# Altium project Enigma Rev B.PrjPCB (part 5 of 8)

## Sheet I2S Audio.SchDoc: I2S Codec/Amplifier
size Tabloid; ApprovedBy: NA; CompanyName: Cospan Design LLC; DrawnBy: Dave McCoy; Engineer: Dave McCoy; DocumentNumber: 13; Revision: A; SheetNumber: 13; SheetTotal: 20; Client: Public; Project: Enigma; ProjectPrettyName: Enigma
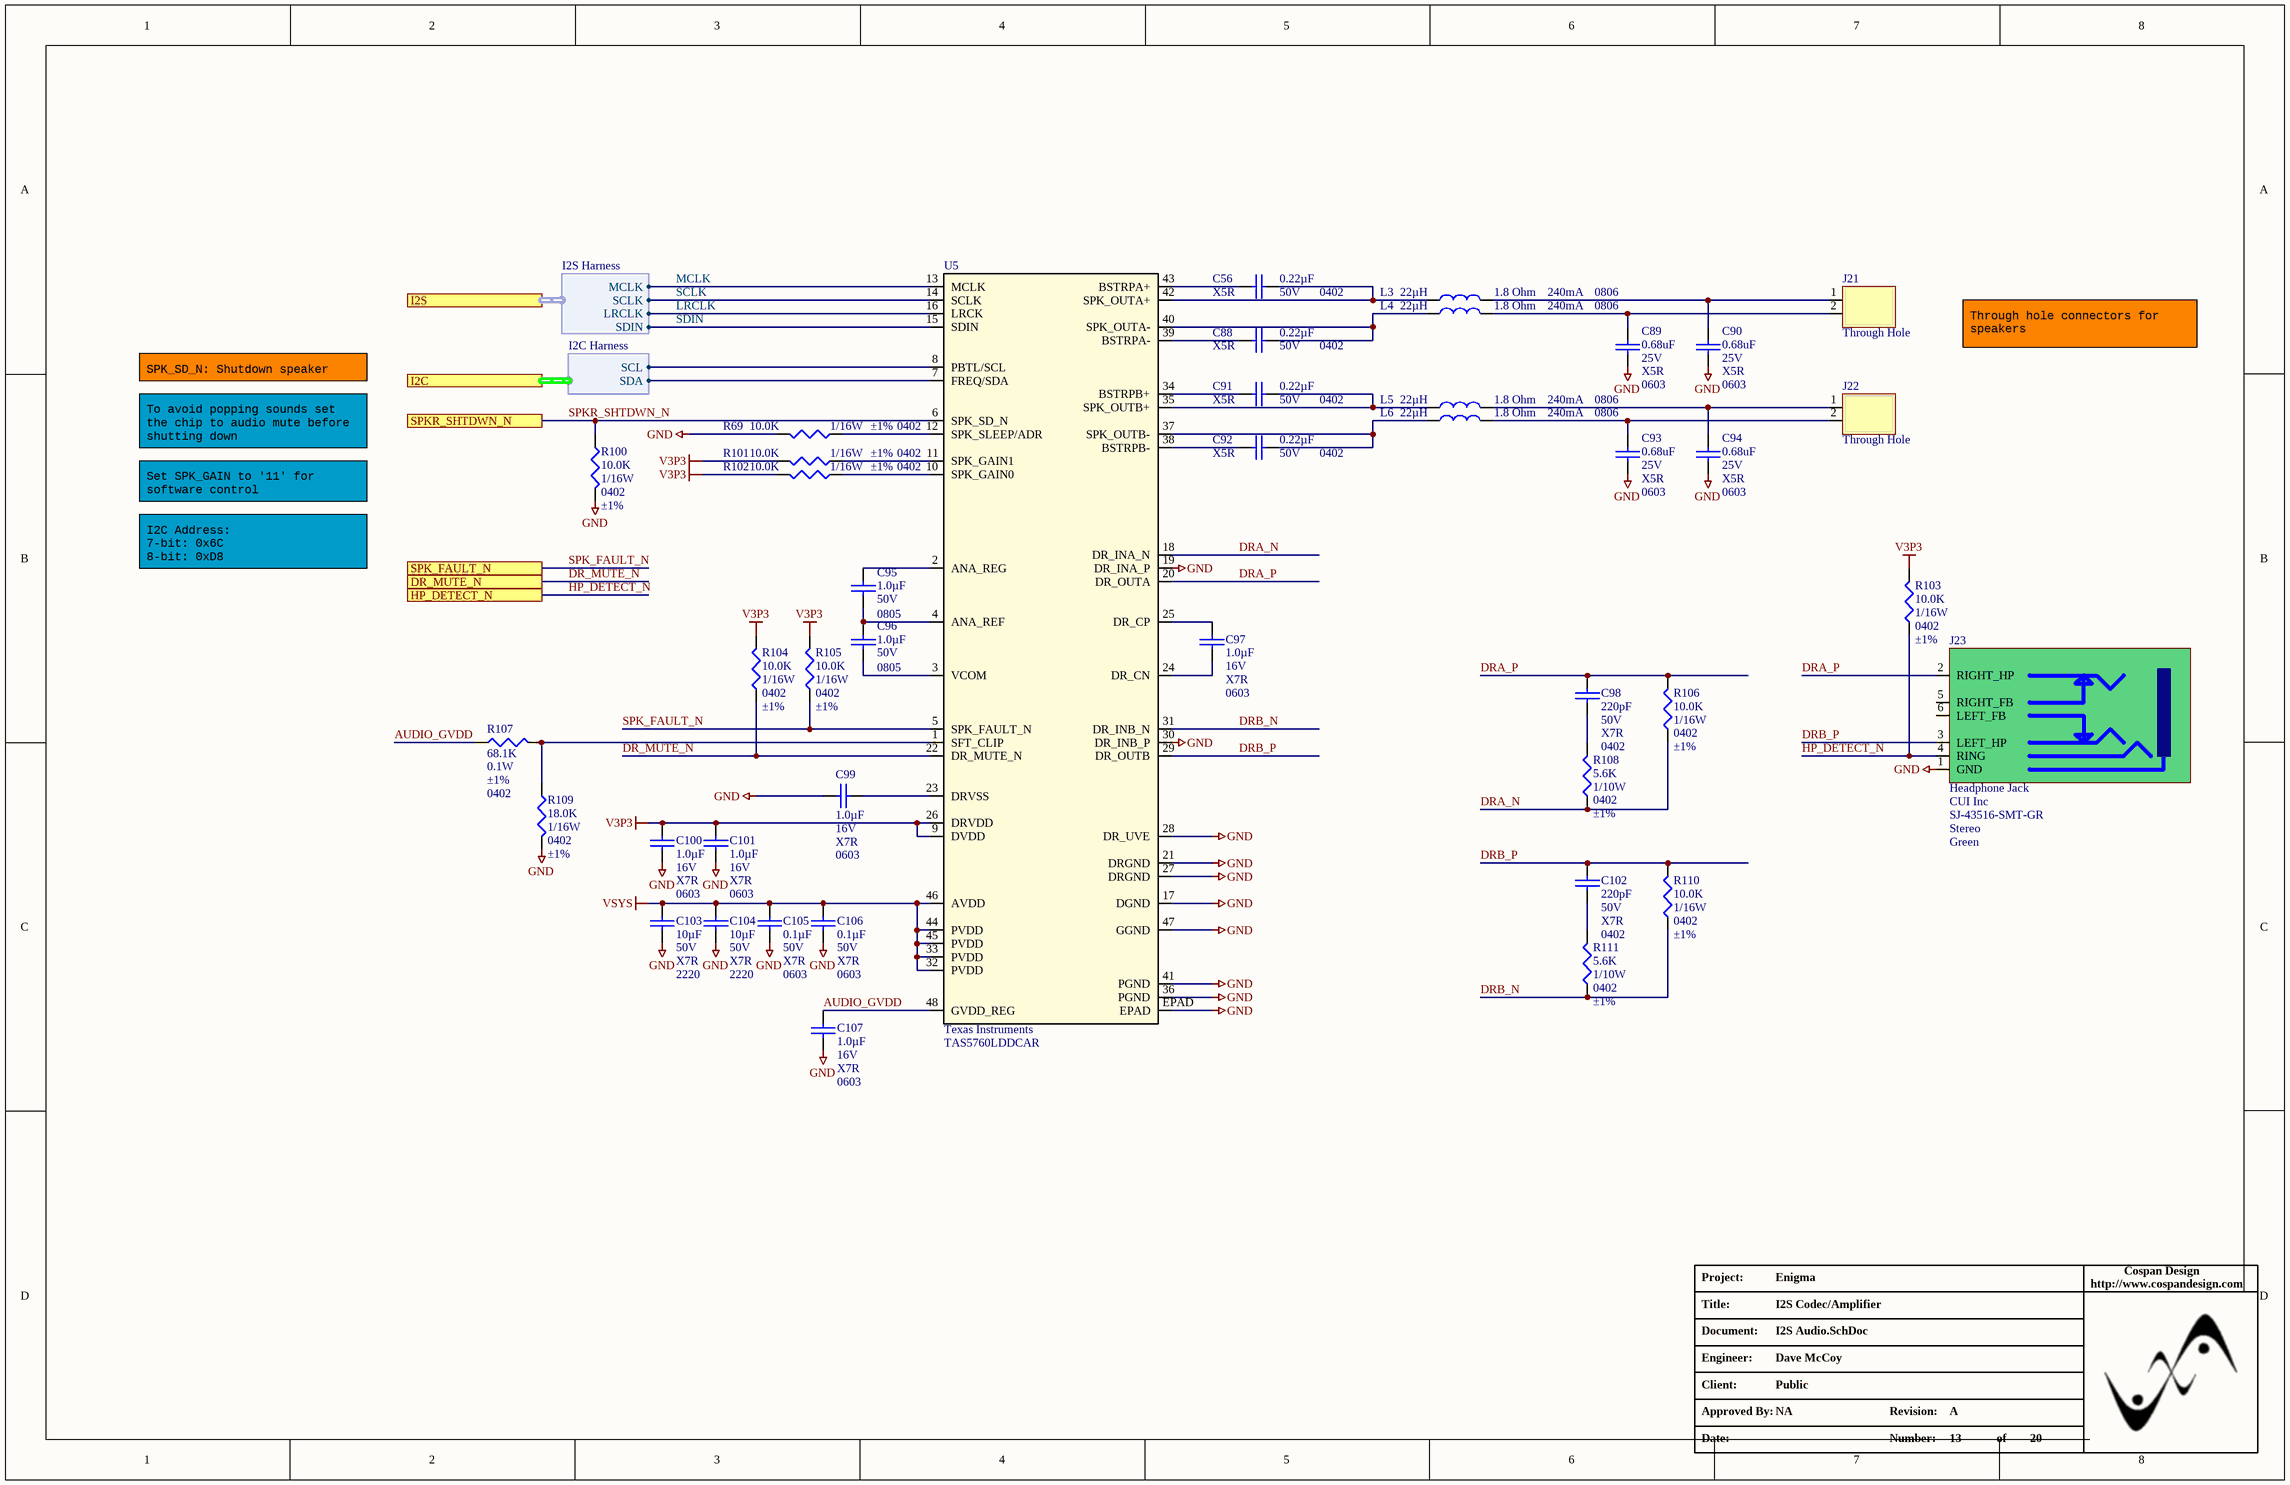
[diagram p8: I2S Audio.SchDoc]

### Parts
C56  Capacitance: 0.22µF  Voltage - Rated: 50V  Temperature Coefficient: X5R  Package / Case: 0402  [C_0402]  (hidden comment: C_0402_0.22UF_50V)
C88  Capacitance: 0.22µF  Voltage - Rated: 50V  Temperature Coefficient: X5R  Package / Case: 0402  [C_0402]  (hidden comment: C_0402_0.22UF_50V)
C89  Capacitance: 0.68uF  Voltage - Rated: 25V  Temperature Coefficient: X5R  Package / Case: 0603  [C_ERA-0603]  (hidden comment: C_0603_0.68uF_25V)
C90  Capacitance: 0.68uF  Voltage - Rated: 25V  Temperature Coefficient: X5R  Package / Case: 0603  [C_ERA-0603]  (hidden comment: C_0603_0.68uF_25V)
C91  Capacitance: 0.22µF  Voltage - Rated: 50V  Temperature Coefficient: X5R  Package / Case: 0402  [C_0402]  (hidden comment: C_0402_0.22UF_50V)
C92  Capacitance: 0.22µF  Voltage - Rated: 50V  Temperature Coefficient: X5R  Package / Case: 0402  [C_0402]  (hidden comment: C_0402_0.22UF_50V)
C93  Capacitance: 0.68uF  Voltage - Rated: 25V  Temperature Coefficient: X5R  Package / Case: 0603  [C_ERA-0603]  (hidden comment: C_0603_0.68uF_25V)
C94  Capacitance: 0.68uF  Voltage - Rated: 25V  Temperature Coefficient: X5R  Package / Case: 0603  [C_ERA-0603]  (hidden comment: C_0603_0.68uF_25V)
C95  Capacitance: 1.0µF  Voltage - Rated: 50V  Package / Case: 0805  [C_ERA-0805]  (hidden comment: 1.0uF)
C96  Capacitance: 1.0µF  Voltage - Rated: 50V  Package / Case: 0805  [C_ERA-0805]  (hidden comment: 1.0uF)
C97  Capacitance: 1.0µF  Voltage - Rated: 16V  Temperature Coefficient: X7R  Package / Case: 0603  [C_ERA-0603]  (hidden comment: 1.0uF)
C98  Voltage - Rated: 50V  Temperature Coefficient: X7R  Package / Case: 0402  [C_0402]  (hidden comment: 220pF)
C99  Capacitance: 1.0µF  Voltage - Rated: 16V  Temperature Coefficient: X7R  Package / Case: 0603  [C_ERA-0603]  (hidden comment: 1.0uF)
C100  Capacitance: 1.0µF  Voltage - Rated: 16V  Temperature Coefficient: X7R  Package / Case: 0603  [C_ERA-0603]  (hidden comment: 1.0uF)
C101  Capacitance: 1.0µF  Voltage - Rated: 16V  Temperature Coefficient: X7R  Package / Case: 0603  [C_ERA-0603]  (hidden comment: 1.0uF)
C102  Voltage - Rated: 50V  Temperature Coefficient: X7R  Package / Case: 0402  [C_0402]  (hidden comment: 220pF)
C103  Voltage - Rated: 50V  Temperature Coefficient: X7R  Package / Case: 2220  [C_ERA-2220]  (hidden comment: 10µF)
C104  Voltage - Rated: 50V  Temperature Coefficient: X7R  Package / Case: 2220  [C_ERA-2220]  (hidden comment: 10µF)
C105  Capacitance: 0.1µF  Voltage - Rated: 50V  Temperature Coefficient: X7R  Package / Case: 0603  [C_ERA-0603]  (hidden comment: C_0603_0.1µF)
C106  Capacitance: 0.1µF  Voltage - Rated: 50V  Temperature Coefficient: X7R  Package / Case: 0603  [C_ERA-0603]  (hidden comment: C_0603_0.1µF)
C107  Capacitance: 1.0µF  Voltage - Rated: 16V  Temperature Coefficient: X7R  Package / Case: 0603  [C_ERA-0603]  (hidden comment: 1.0uF)
J21  Mounting Type: Through Hole  [HDR_1X2]  (hidden comment: J_HDR1X2_JUMPER)  (no BOM)
J22  Mounting Type: Through Hole  [HDR_1X2]  (hidden comment: J_HDR1X2_JUMPER)  (no BOM)
J23  Headphone Jack  Manufacturer: CUI Inc  Manufacturer Part Number: SJ-43516-SMT-GR  Signal Lines: Stereo  Color: Green  [HEADPHONE_JACK]
L3  Current: 240mA  Package / Case: 0806  Inductance: 22µH  DC Resistance (DCR): 1.8 Ohm  [L_0806]  (hidden comment: CBC2016T220K)
L4  Current: 240mA  Package / Case: 0806  Inductance: 22µH  DC Resistance (DCR): 1.8 Ohm  [L_0806]  (hidden comment: CBC2016T220K)
L5  Current: 240mA  Package / Case: 0806  Inductance: 22µH  DC Resistance (DCR): 1.8 Ohm  [L_0806]  (hidden comment: CBC2016T220K)
L6  Current: 240mA  Package / Case: 0806  Inductance: 22µH  DC Resistance (DCR): 1.8 Ohm  [L_0806]  (hidden comment: CBC2016T220K)
R69  Resistance In Ohms: 10.0K  Power (Watts): 1/16W  Case: 0402  Tolerance: ±1%  [R_0402]  (hidden comment: R_0402_10.0K)
R100  Resistance In Ohms: 10.0K  Power (Watts): 1/16W  Case: 0402  Tolerance: ±1%  [R_0402]  (hidden comment: R_0402_10.0K)
R101  Resistance In Ohms: 10.0K  Power (Watts): 1/16W  Case: 0402  Tolerance: ±1%  [R_0402]  (hidden comment: R_0402_10.0K)
R102  Resistance In Ohms: 10.0K  Power (Watts): 1/16W  Case: 0402  Tolerance: ±1%  [R_0402]  (hidden comment: R_0402_10.0K)
R103  Resistance In Ohms: 10.0K  Power (Watts): 1/16W  Case: 0402  Tolerance: ±1%  [R_0402]  (hidden comment: R_0402_10.0K)
R104  Resistance In Ohms: 10.0K  Power (Watts): 1/16W  Case: 0402  Tolerance: ±1%  [R_0402]  (hidden comment: R_0402_10.0K)
R105  Resistance In Ohms: 10.0K  Power (Watts): 1/16W  Case: 0402  Tolerance: ±1%  [R_0402]  (hidden comment: R_0402_10.0K)
R106  Resistance In Ohms: 10.0K  Power (Watts): 1/16W  Case: 0402  Tolerance: ±1%  [R_0402]  (hidden comment: R_0402_10.0K)
R107  Resistance In Ohms: 68.1K  Power (Watts): 0.1W  Tolerance: ±1%  Case: 0402  [R_0402]  (hidden comment: R_0402_68.1K)
R108  Resistance In Ohms: 5.6K  Power (Watts): 1/10W  Case: 0402  Tolerance: ±1%  [R_0402]  (hidden comment: 5.6k Ohms)
R109  Resistance In Ohms: 18.0K  Power (Watts): 1/16W  Case: 0402  Tolerance: ±1%  [R_0402]  (hidden comment: 18.0k Ohms)
R110  Resistance In Ohms: 10.0K  Power (Watts): 1/16W  Case: 0402  Tolerance: ±1%  [R_0402]  (hidden comment: R_0402_10.0K)
R111  Resistance In Ohms: 5.6K  Power (Watts): 1/10W  Case: 0402  Tolerance: ±1%  [R_0402]  (hidden comment: 5.6k Ohms)
U5  Manufacturer 1: Texas Instruments  Manufacturer Part Number 1: TAS5760LDDCAR  [DCA48_6P4X3P6]  (hidden comment: U_TAS5760LDDCAR)

### Ports
DR_MUTE_N, HP_DETECT_N, I2C (harness I2C Harness), I2S (harness I2S Harness), SPK_FAULT_N, SPKR_SHTDWN_N

### Harnesses
I2C Harness: SCL, SDA
I2S Harness: MCLK, SCLK, LRCLK, SDIN

### Nets
GND: C89.1 C90.1 C93.1 C94.1 C99.1 C100.1 C101.1 C103.1 C104.1 C105.1 C106.1 C107.1 J23.1(GND) R69.1 R100.1 R109.2 U5.17(DGND) U5.19(DR_INA_P) U5.21(DRGND) U5.27(DRGND) U5.28(DR_UVE) U5.30(DR_INB_P) U5.36(PGND) U5.41(PGND) U5.47(GGND) U5.EPAD
V3P3: C100.2 C101.2 R101.1 R102.1 R103.1 R104.2 R105.2 U5.9(DVDD) U5.26(DRVDD)
VSYS: C103.2 C104.2 C105.2 C106.2 U5.32(PVDD) U5.33(PVDD) U5.44(PVDD) U5.45(PVDD) U5.46(AVDD)
AUDIO_GVDD: C107.2 R107.1 U5.48(GVDD_REG)
DR_MUTE_N: R104.1 U5.22(DR_MUTE_N) ; port DR_MUTE_N
DRA_N: R106.2 R108.2 U5.18(DR_INA_N)
DRA_P: C98.2 J23.2(RIGHT_HP) R106.1 U5.20(DR_OUTA)
DRB_N: R110.2 R111.2 U5.31(DR_INB_N)
DRB_P: C102.2 J23.3(LEFT_HP) R110.1 U5.29(DR_OUTB)
FMC_SCL: U5.8(PBTL/SCL) ; port I2C.SCL
FMC_SDA: U5.7(FREQ/SDA) ; port I2C.SDA
HP_DETECT_N: J23.4(RING) R103.2 ; port HP_DETECT_N
LRCLK: U5.16(LRCK) ; port I2S.LRCLK
MCLK: U5.13(MCLK) ; port I2S.MCLK
SCLK: U5.14(SCLK) ; port I2S.SCLK
SDIN: U5.15(SDIN) ; port I2S.SDIN
SPK_FAULT_N: R105.1 U5.5(SPK_FAULT_N) ; port SPK_FAULT_N
SPKR_SHTDWN_N: R100.2 U5.6(SPK_SD_N) ; port SPKR_SHTDWN_N
NetC56_1: C56.1 L3.1 U5.42(SPK_OUTA+)
NetC56_2: C56.2 U5.43(BSTRPA+)
NetC88_1: C88.1 L4.1 U5.40(SPK_OUTA-)
NetC88_2: C88.2 U5.39(BSTRPA-)
NetC89_2: C89.2 J21.2 L4.2
NetC90_2: C90.2 J21.1 L3.2
NetC91_1: C91.1 L5.1 U5.35(SPK_OUTB+)
NetC91_2: C91.2 U5.34(BSTRPB+)
NetC92_1: C92.1 L6.1 U5.37(SPK_OUTB-)
NetC92_2: C92.2 U5.38(BSTRPB-)
NetC93_2: C93.2 J22.2 L6.2
NetC94_2: C94.2 J22.1 L5.2
NetC95_1: C95.1 C96.2 U5.4(ANA_REF)
NetC95_2: C95.2 U5.2(ANA_REG)
NetC96_1: C96.1 U5.3(VCOM)
NetC97_1: C97.1 U5.24(DR_CN)
NetC97_2: C97.2 U5.25(DR_CP)
NetC98_1: C98.1 R108.1
NetC99_2: C99.2 U5.23(DRVSS)
NetC102_1: C102.1 R111.1
NetR69_2: R69.2 U5.12(SPK_SLEEP/ADR)
NetR101_2: R101.2 U5.11(SPK_GAIN1)
NetR102_2: R102.2 U5.10(SPK_GAIN0)
NetR107_2: R107.2 R109.1 U5.1(SFT_CLIP)

Not connected (* = marked no-connect by the designer): J23 5(RIGHT_FB) 6(LEFT_FB)

### Notes on the sheet
- Through hole connectors for speakers
- SPK_SD_N: Shutdown speaker
- Set SPK_GAIN to '11' for software control
- To avoid popping sounds set the chip to audio mute before shutting down
- I2C Address:
  7-bit: 0x6C
  8-bit: 0xD8
- Project:
- http://www.cospandesign.com
- Cospan Design
- Document:
- Engineer:
- Title:
- Client:
- Approved By:
- Revision:
- Date:
- Number:
- of

### Library data of the parts
C56 C88 C91 C92 = C_0402_0.22UF_50V: CAP CER 0.22UF 50V X5R 0402; Manufacturer: Taiyo Yuden; Manufacturer Part Number: UMK105BJ224KV-F; Tolerance: ±10%; Supplier 1: Digi-Key; RoHS: RoHS Compliant; Category: Capacitors; Stock 1: 141424; Pricing 1: 1=0.35, 10=0.263, 50=0.1532, 100=0.1225, 250=0.08752, 500=0.0595, 1000=0.04813, 5000=0.03763 (USD); Packaging: Digi-Reel®; Mounting Type: Surface Mount, MLCC; Operating Temperature: -55°C ~ 85°C; Applications: General Purpose; Ratings: -; Size / Dimension: 0.039" L x 0.020" W (1.00mm x 0.50mm); Height - Seated (Max): -; Thickness (Max): 0.022" (0.55mm); Lead Spacing: -; Features: -; Lead Style: -; ComponentLink1URL: http://ds.yuden.co.jp/TYCOMPAS/ut/detail.do?productNo=UMK105BJ224KV-F&fileName=UMK105BJ224KV-F_SS&mode=specSheetDownload; ComponentLink1Description: http://ds.yuden.co.jp/TYCOMPAS/ut/detail.do?productNo=UMK105BJ224KV-F&fileName=UMK105BJ224KV-F_SS&mode=specSheetDownload; Supplier Part Number 1: 587-3500-6-ND
C89 C90 C93 C94 = C_0603_0.68uF_25V: CAP CER 0.68UF 25V X5R 0603; Manufacturer: Wurth Electronics Inc.; Manufacturer Part Number: 885012106021; Tolerance: ±20%; Supplier 1: Digi-Key; RoHS: RoHS Compliant; Category: Capacitors; Stock 1: 3388; Pricing 1: 1=0.16, 50=0.131, 100=0.103, 250=0.091, 500=0.083, 1000=0.077 (USD); Packaging: Cut Tape (CT); Part Status: Active; Operating Temperature: -55°C ~ 85°C; Features: -; Ratings: -; Applications: General Purpose; Mounting Type: Surface Mount, MLCC; Size / Dimension: 0.063" L x 0.031" W (1.60mm x 0.80mm); Height - Seated (Max): -; Thickness (Max): 0.037" (0.95mm); Lead Spacing: -; Lead Style: -; ComponentLink1URL: http://katalog.we-online.de/pbs/datasheet/885012106021.pdf; ComponentLink1Description: http://katalog.we-online.de/pbs/datasheet/885012106021.pdf; Supplier Part Number 1: 732-7918-1-ND
C95 C96 = C_0805_1.0uF_50V: CAP CER 1UF 50V X7R 0805; Manufacturer: Murata Electronics North America; Manufacturer Part Number: GRM21BR71H105KA12L; Tolerance: ±10%; Supplier 1: Digi-Key; RoHS: RoHS Compliant; Category: Capacitors; Stock 1: 322160; Pricing 1: 10=0.529, 100=0.3127, 500=0.18038, 1000=0.12506 (USD); Mounting Type: Surface Mount, MLCC; Operating Temperature: -55°C ~ 125°C; Features: -; Applications: General Purpose; Ratings: -; Size / Dimension: 0.079" L x 0.049" W (2.00mm x 1.25mm); Lead Spacing: -; Thickness: 1.25mm; Packaging: Cut Tape (CT); Lead Style: -; ComponentLink1URL: http://search.murata.co.jp/Ceramy/image/img/PDF/ENG/GRM21BR71H105KA12.pdf; ComponentLink1Description: http://search.murata.co.jp/Ceramy/image/img/PDF/ENG/GRM21BR71H105KA12.pdf; Supplier Part Number 1: 490-4736-1-ND; Temperature Coefficient: X7R
C97 C99-C101 C107 = C_0603_1.0uF_16V: CAP CER 1UF 16V 10% X7R 0603; Manufacturer: Yageo; Manufacturer Part Number: CC0603KRX7R7BB105; Supplier 1: Digi-Key; Supplier Part Number 1: 311-1446-1-ND; RoHS: RoHS Compliant; Category: Capacitors; Stock 1: 221087; Tolerance: ±10%; Mounting Type: Surface Mount, MLCC; Operating Temperature: -55°C ~ 125°C; Applications: General Purpose; Ratings: -; Size / Dimension: 0.063" L x 0.032" W (1.60mm x 0.80mm); Height - Seated (Max): -; Thickness (Max): 0.035" (0.90mm); Lead Spacing: -; Features: -; Packaging: Cut Tape (CT); Lead Style: -; ComponentLink1URL: http://www.yageo.com/documents/recent/UPY-GPHC_X7R_6.3V-to-50V_18.pdf; ComponentLink1Description: http://www.yageo.com/documents/recent/UPY-GPHC_X7R_6.3V-to-50V_18.pdf; Pricing 1: 1=0.1, 10=0.053, 100=0.0237, 500=0.01694, 1000=0.01331 (USD); Part Status: Active; Failure Rate: -
C98 C102 = C_0402_220PF_50V: CAP CER 220PF 50V 10% X7R 0402; Manufacturer: Murata Electronics North America; Manufacturer Part Number: GRM155R71H221KA01D; Supplier 1: Digi-Key; Supplier Part Number 1: 490-1298-1-ND; RoHS: RoHS Compliant; Category: Capacitors; Stock 1: 239876; Pricing: 10=0.034, 50=0.0272, 100=0.0204, 250=0.01476, 500=0.0109, 1000=0.00738 (USD); Tolerance: ±10%; Mounting Type: Surface Mount, MLCC; Operating Temperature: -55°C ~ 125°C; Applications: General Purpose; Ratings: -; Size / Dimension: 0.039" L x 0.020" W (1.00mm x 0.50mm); Height: -; Thickness: 0.022" (0.55mm); Lead Spacing: -; Features: -; Packaging: Cut Tape (CT); Lead Style: -; ComponentLink1URL: http://search.murata.co.jp/Ceramy/image/img/PDF/ENG/GRM155R71H221KA01.pdf; ComponentLink1Description: http://search.murata.co.jp/Ceramy/image/img/PDF/ENG/GRM155R71H221KA01.pdf; Capacitance: 220pF
C103 C104 = C_2220_10UF_50V: CAP CER 10UF 50V X7R 20% 2220; Manufacturer: TDK Corporation; Manufacturer Part Number: C5750X7R1H106K230KB; Tolerance: ±10%; Supplier 1: Digi-Key; RoHS: RoHS Compliant; Category: Capacitors; Stock 1: 35258; Pricing 1: 1=1.96, 10=1.583, 100=1.2087 (USD); Packaging: Cut Tape (CT); Part Status: Active; Operating Temperature: -55°C ~ 125°C; Features: -; Ratings: -; Applications: General Purpose; Failure Rate: -; Mounting Type: Surface Mount, MLCC; Size / Dimension: 0.224" L x 0.197" W (5.70mm x 5.00mm); Height - Seated (Max): -; Thickness (Max): 0.098" (2.50mm); Lead Spacing: -; Lead Style: -; ComponentLink1URL: https://product.tdk.com/info/en/catalog/datasheets/mlcc_commercial_general_en.pdf; ComponentLink1Description: https://product.tdk.com/info/en/catalog/datasheets/mlcc_commercial_general_en.pdf; Supplier Part Number 1: 445-3492-1-ND; Capacitance: 10µF
C105 C106 = C_0603_0.1µF: CAP CER 0.1UF 50V X7R 0603; Manufacturer: Samsung Electro-Mechanics America, Inc.; Manufacturer Part Number: CL10B104KB8SFNC; Tolerance: ±10%; Supplier 1: Digi-Key; RoHS: RoHS Compliant; Category: Capacitors; Stock 1: 1364172; Pricing 1: 1=0.1, 10=0.027, 25=0.0192, 50=0.0148, 100=0.0125, 500=0.00874, 1000=0.00681 (USD); Packaging: Cut Tape (CT); Mounting Type: Surface Mount, MLCC; Operating Temperature: -55°C ~ 125°C; Applications: Boardflex Sensitive; Ratings: -; Size / Dimension: 0.063" L x 0.031" W (1.60mm x 0.80mm); Height - Seated (Max): -; Thickness (Max): 0.035" (0.90mm); Lead Spacing: -; Features: Soft Termination; Lead Style: -; ComponentLink1URL: http://www.samsungsem.com/kr/support/product-search/mlcc/CL10B104KB8SFNC.jsp; ComponentLink1Description: http://www.samsungsem.com/kr/support/product-search/mlcc/CL10B104KB8SFNC.jsp; Supplier Part Number 1: 1276-1936-1-ND; Supplier 2: Digi-Key; Stock 2: 470947; Pricing 2: 1=0.1, 10=0.026, 50=0.0144, 100=0.0121, 250=0.00992, 500=0.00848, 1000=0.0066 (USD); ComponentLink2URL: http://www.kemet.com/docfinder?Partnumber=C0603C104M5RACTU; ComponentLink2Description: http://www.kemet.com/docfinder?Partnumber=C0603C104M5RACTU; Supplier Part Number 2: 399-7845-1-ND
J21 J22 = J_HDR1X2_JUMPER: CONN HEADER .100" 2POS TIN PCB; Manufacturer: Samtec; Manufacturer Part Number: TSW-102-07-T-S; Number of Positions: 2; Connector Type: Unshrouded; Number of Positions Loaded: All; Pitch: 0.100" (2.54mm); NOTE: This is a 1X12 header; Category: Connectors, Interconnects; Number of Rows: 1; Supplier 1: Samtec; Supplier Part Number 1: TSW-102-07-T-S; RoHS: RoHS Compliant; Row Spacing: -; Height Stacking (Mating): -; Molding Height Above Board: 0.100" (2.54mm); Contact Mating Length: 0.166" (4.22mm); Termination: Solder; Contact Finish: Tin; Contact Finish Thickness: 200µin (5.08µm); Features: -; Color: Black; ComponentLink1URL: http://www.samtec.com/ftppub/pdf/TD.PDF; ComponentLink1Description: http://www.samtec.com/ftppub/pdf/TD.PDF
J23 = J_HEADPHONE_JACK: CONN AUDIO JACK 3.5MM 4COND SMD; Gender: Female; Plug/Mating Plug Diameter: 3.50mm (0.141", 1/8", Mini Plug) - Headphone; Number of Positions/Contacts: 4 Conductors, 6 Contacts; Internal Switch(s): Two Switches; Shielding: Unshielded; Supplier 1: Digi-Key; Supplier Part Number 1: CP-43516SJGRCT-ND; RoHS: RoHS Compliant; Category: Connectors, Interconnects; Stock 1: 3934; Pricing: 1=1.26, 10=0.982, 100=0.749, 500=0.59796 (USD); Connector Type: Phone Jack; Mounting Type: Surface Mount, Right Angle; Termination: Solder; Features: Board Guide; Packaging: Cut Tape (CT); ComponentLink1URL: http://products.cui.com/GetSpecForDigikey.aspx?MFGNum=SJ-43516-SMT; ComponentLink1Description: http://products.cui.com/GetSpecForDigikey.aspx?MFGNum=SJ-43516-SMT
L3-L6 = L_0806_22uH: INDUCTOR 22UH 10% 0806 SMD; Manufacturer: Taiyo Yuden; Type: Wirewound; Current - Saturation: 250mA; Shielding: Unshielded; Frequency - Self Resonant: 16MHz; Frequency - Test: 2.52MHz; Supplier 1: Digi-Key; Supplier Part Number 1: 587-3048-1-ND; Manufacturer Part Number: CBC2016T220K; RoHS: RoHS Compliant; Category: Inductors, Coils, Chokes; Stock 1: 3275; Pricing: 1=0.2, 10=0.192, 50=0.18, 100=0.168, 500=0.132, 1000=0.108 (USD); Packaging: Cut Tape (CT); Material - Core: -; Tolerance: ±10%; Current Rating: 240mA; Q @ Freq: -; Operating Temperature: -40°C ~ 105°C; Mounting Type: Surface Mount; Size / Dimension: 0.079" L x 0.063"W (2.00mm x 1.60mm); Height - Seated (Max): 0.071" (1.80mm); Supplier Device Package: 0806 (2016 Metric); ComponentLink1URL: http://www.yuden.co.jp/ut/product/category/inductor/CBC2016T220K.pdf; ComponentLink1Description: http://www.yuden.co.jp/ut/product/category/inductor/CBC2016T220K.pdf
R69 R100-R106 R110 = R_0402_10.0K: RES 10.0K OHM 1/16W 1% 0402 SMD; Manufacturer: Stackpole Electronics Inc; Manufacturer Part Number: RMCF0402FT10K0; Resistance (Ohms): 10k; Temperature Coefficient: ±100ppm/°C; Supplier 1: Digi-Key; Supplier Part Number 1: RMCF0402FT10K0CT-ND; RoHS: RoHS Compliant; Category: Resistors; Stock 1: 234525; Pricing: 1=0.04, 10=0.025, 50=0.0138, 100=0.0105, 250=0.0078, 500=0.00576, 1000=0.00384, 2500=0.00324, 5000=0.0027 (USD); Composition: Thick Film; Features: -; Package / Case: 0402 (1005 Metric); Size / Dimension: 0.039" L x 0.020" W (1.00mm x 0.50mm); Height: 0.016" (0.40mm); Number of Terminations: 2; Packaging: Cut Tape (CT); ComponentLink1URL: http://www.seielect.com/Catalog/SEI-RMCF_RMCP.pdf; ComponentLink1Description: http://www.seielect.com/Catalog/SEI-RMCF_RMCP.pdf
R107 = R_0402_68.1K: RES 68.1K OHM 1/10W 1% 0402 SMD; Manufacturer: Panasonic - ECG; Manufacturer Part Number: ERJ-2RKF6812X; Temperature Coefficient: ±100ppm/°C; Supplier 1: Digi-Key; Supplier Part Number 1: P68.1KLCT-ND; RoHS: RoHS Compliant; Category: Resistors; Stock 1: 314739; Pricing: 1=0.06, 50=0.0242, 100=0.0184, 250=0.01364, 500=0.01008, 1000=0.00672, 5000=0.00473 (USD); Resistance (Ohms): 68.1K; Composition: Thick Film; Features: -; Size / Dimension: 0.039" L x 0.020" W (1.00mm x 0.50mm); Height: 0.014" (0.35mm); Number of Terminations: 2; Packaging: Cut Tape (CT); Package / Case: 0402 (1005 Metric); ComponentLink1URL: http://industrial.panasonic.com/www-cgi/jvcr13pz.cgi?E+PZ+3+AOA0002+ERJ2RKF6812X+7+WW; ComponentLink1Description: http://industrial.panasonic.com/www-cgi/jvcr13pz.cgi?E+PZ+3+AOA0002+ERJ2RKF6812X+7+WW
R108 R111 = R_0402_5.6K: RES 5.60K OHM 1/10W 1% 0402 SMD; Manufacturer: Yageo; Manufacturer Part Number: RC0402FR-075K6L; Temperature Coefficient: ±100ppm/°C; Supplier 1: Digi-Key; Supplier Part Number 1: 311-5.6KLRCT-ND; RoHS: RoHS Compliant; Category: Resistors; Stock 1: 1026789; Composition: Thick Film; Features: Moisture Resistant; Package / Case: 0402 (1005 Metric); Size / Dimension: 0.039" L x 0.020" W (1.00mm x 0.50mm); Packaging: Cut Tape (CT); ComponentLink1URL: http://www.yageo.com/documents/recent/PYu-RC_Group_51_RoHS_L_7.pdf; ComponentLink1Description: http://www.yageo.com/documents/recent/PYu-RC_Group_51_RoHS_L_7.pdf; Pricing 1: 1=0.1, 10=0.014, 100=0.0056, 1000=0.00253, 2500=0.0022, 5000=0.00181 (USD); Part Status: Active; Operating Temperature: -55°C ~ 155°C; Supplier Device Package: 0402; Height - Seated (Max): 0.016" (0.40mm); Failure Rate: -
R109 = R_0402_18.0K: RES SMD 18K OHM 1% 1/16W 0402; Manufacturer: Yageo; Manufacturer Part Number: RC0402FR-0718KL; Temperature Coefficient: ±100ppm/°C; Supplier 1: Digi-Key; Supplier Part Number 1: 311-18.0KLRCT-ND; RoHS: RoHS Compliant; Category: Resistors; Stock 1: 2103351; Pricing: 10=0.014, 100=0.0063, 500=0.00382, 1000=0.0027, 5000=0.00203 (USD); Resistance (Ohms): 18K; Composition: Thick Film; Features: -; Package / Case: 0402 (1005 Metric); Size / Dimension: 0.039" L x 0.020" W (1.00mm x 0.50mm); Height: 0.016" (0.40mm); Number of Terminations: 2; Packaging: Cut Tape (CT); ComponentLink1URL: http://www.yageo.com/documents/recent/PYu-RC0402_51_RoHS_L_6.pdf; ComponentLink1Description: http://www.yageo.com/documents/recent/PYu-RC0402_51_RoHS_L_6.pdf
U5 = U_TAS5760LDDCAR: IC AUDIO AMP DGTL D 48HTSSOP; Description 1: Audio Amp Headphone/Speaker 1-CH Mono/2-CH Stereo 30W Class-D 48-Pin HTSSOP EP T/R; Power Supply Rejection Ratio (PSRR): 40dB; ComponentLink1URL: http://www.ti.com/lit/ds/symlink/tas5760l.pdf; ComponentLink1Description: http://www.ti.com/lit/ds/symlink/tas5760l.pdf; Supplier 1: Digi-Key; Supplier Part Number 1: 296-40567-6-ND; Stock 1: 1210; Pricing 1: 1=5.5, 10=4.94, 100=4.0471, 500=3.44524, 1000=2.90563 (USD); Mount: Surface Mount; Case/Package: HTSSOP EP; Number of Pins: 48; Min Operating Temperature: -25°C; Max Operating Temperature: 85°C; Package Quantity: 2000; Packaging: Tape and Reel; Radiation Hardening: No; Lead Free: Lead Free; ComponentLink2URL: https://datasheet.ciiva.com/29639/tas5760l-29639378.pdf; ComponentLink2Description: https://datasheet.ciiva.com/29639/tas5760l-29639378.pdf; ComponentLink3URL: https://datasheet.ciiva.com/29896/tas5760ld-29896300.pdf; ComponentLink3Description: https://datasheet.ciiva.com/29896/tas5760ld-29896300.pdf

## Sheet USB Phy.SchDoc: USB Phy
size Tabloid; ApprovedBy: NA; CompanyName: Cospan Design LLC; DrawnBy: Dave McCoy; Engineer: Dave McCoy; DocumentNumber: 8; Revision: A; SheetNumber: 8; SheetTotal: 20; Client: Public; Project: Enigma; ProjectPrettyName: Enigma
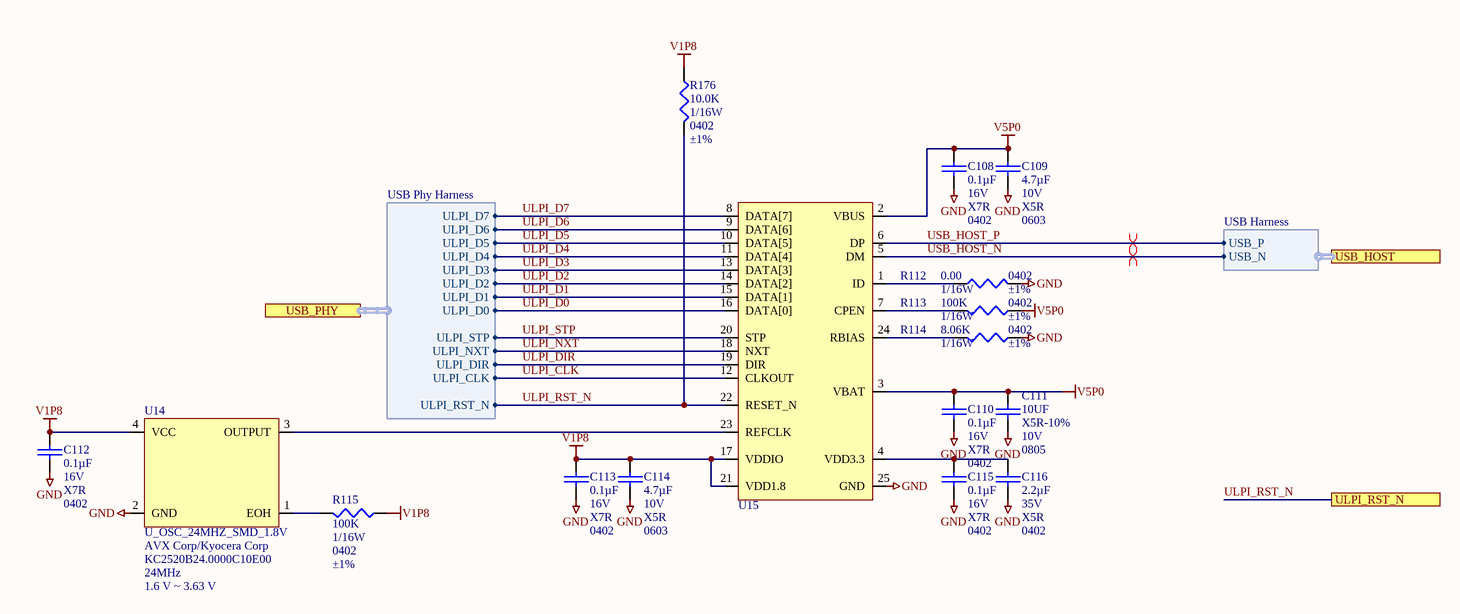
[diagram p9: USB Phy.SchDoc]

### Parts
C108  Capacitance: 0.1µF  Voltage - Rated: 16V  Temperature Coefficient: X7R  Package / Case: 0402  [C_0402]  (hidden comment: 0.1uF)
C109  Voltage - Rated: 10V  Temperature Coefficient: X5R  Package / Case: 0603  [C_ERA-0603]  (hidden comment: 4.7µF)
C110  Capacitance: 0.1µF  Voltage - Rated: 16V  Temperature Coefficient: X7R  Package / Case: 0402  [C_0402]  (hidden comment: 0.1uF)
C111  10UF  TOLERANCE: X5R-10%  VOLTS: 10V  FOOTPRINT: 0805  [C_0805]
C112  Capacitance: 0.1µF  Voltage - Rated: 16V  Temperature Coefficient: X7R  Package / Case: 0402  [C_0402]  (hidden comment: 0.1uF)
C113  Capacitance: 0.1µF  Voltage - Rated: 16V  Temperature Coefficient: X7R  Package / Case: 0402  [C_0402]  (hidden comment: 0.1uF)
C114  Voltage - Rated: 10V  Temperature Coefficient: X5R  Package / Case: 0603  [C_ERA-0603]  (hidden comment: 4.7µF)
C115  Capacitance: 0.1µF  Voltage - Rated: 16V  Temperature Coefficient: X7R  Package / Case: 0402  [C_0402]  (hidden comment: 0.1uF)
C116  Capacitance: 2.2µF  Voltage - Rated: 35V  Temperature Coefficient: X5R  Package / Case: 0402  [C_ERA-0402]  (hidden comment: C_0402_2.2uF_35V)
R112  Resistance In Ohms: 0.00  Power (Watts): 1/16W  Case: 0402  Tolerance: ±1%  [R_0402]  (hidden comment: 0.0 Ohms)
R113  Resistance In Ohms: 100K  Power (Watts): 1/16W  Case: 0402  Tolerance: ±1%  [R_0402]  (hidden comment: R_0402_100K)
R114  Resistance In Ohms: 8.06K  Power (Watts): 1/16W  Case: 0402  Tolerance: ±1%  [R_0402]  (hidden comment: R_0402_8.06K)
R115  Resistance In Ohms: 100K  Power (Watts): 1/16W  Case: 0402  Tolerance: ±1%  [R_0402]  (hidden comment: R_0402_100K)
R176  Resistance In Ohms: 10.0K  Power (Watts): 1/16W  Case: 0402  Tolerance: ±1%  [R_0402]  (hidden comment: R_0402_10.0K)
U14  U_OSC_24MHZ_SMD_1.8V  Manufacturer: AVX Corp/Kyocera Corp  Manufacturer Part Number: KC2520B24.0000C10E00  Frequency: 24MHz  Voltage - Supply: 1.6 V ~ 3.63 V  [KC2520B]
U15  U_USB3315C  [QFN50P400X400X100_HS-25N]  (value not drawn)

### Ports
ULPI_RST_N, USB_HOST (harness USB Harness), USB_PHY (harness USB Phy Harness)

### Harnesses
USB Phy Harness: ULPI_D7, ULPI_D6, ULPI_D5, ULPI_D4, ULPI_D3, ULPI_D2, ULPI_D1, ULPI_D0, ULPI_STP, ULPI_NXT, ULPI_DIR, ULPI_CLK, ULPI_RST_N
USB Harness: USB_P, USB_N

### Nets
GND: C108.1 C109.1 C110.1 C111.1 C112.1 C113.1 C114.1 C115.1 C116.1 R112.1 R114.2 U14.2(GND) U15.25(GND)
V1P8: C112.2 C113.2 C114.2 R115.2 R176.2 U14.4(VCC) U15.17(VDDIO) U15.21(VDD1.8)
V5P0: C108.2 C109.2 C110.2 C111.2 R113.2 U15.2(VBUS) U15.3(VBAT)
ULPI_CLK: U15.12(CLKOUT) ; port USB_PHY.ULPI_CLK
ULPI_D0: U15.16(DATA[0]) ; port USB_PHY.ULPI_D0
ULPI_D1: U15.15(DATA[1]) ; port USB_PHY.ULPI_D1
ULPI_D2: U15.14(DATA[2]) ; port USB_PHY.ULPI_D2
ULPI_D3: U15.13(DATA[3]) ; port USB_PHY.ULPI_D3
ULPI_D4: U15.11(DATA[4]) ; port USB_PHY.ULPI_D4
ULPI_D5: U15.10(DATA[5]) ; port USB_PHY.ULPI_D5
ULPI_D6: U15.9(DATA[6]) ; port USB_PHY.ULPI_D6
ULPI_D7: U15.8(DATA[7]) ; port USB_PHY.ULPI_D7
ULPI_DIR: U15.19(DIR) ; port USB_PHY.ULPI_DIR
ULPI_NXT: U15.18(NXT) ; port USB_PHY.ULPI_NXT
ULPI_RST_N: R176.1 U15.22(RESET_N) ; port ULPI_RST_N, port USB_PHY.ULPI_RST_N
ULPI_STP: U15.20(STP) ; port USB_PHY.ULPI_STP
USB_HOST_N: U15.5(DM) ; port USB_HOST.USB_N
USB_HOST_P: U15.6(DP) ; port USB_HOST.USB_P
NetC115_2: C115.2 C116.2 U15.4(VDD3.3)
NetR112_2: R112.2 U15.1(ID)
NetR113_1: R113.1 U15.7(CPEN)
NetR114_1: R114.1 U15.24(RBIAS)
NetR115_1: R115.1 U14.1(EOH)
NetU14_3: U14.3(OUTPUT) U15.23(REFCLK)

### Layout directives
differential pair: USB_HOST_N, USB_HOST_P

### Notes on the sheet
- Project:
- http://www.cospandesign.com
- Cospan Design
- Document:
- Engineer:
- Title:
- Client:
- Approved By:
- Revision:
- Date:
- Number:
- of

### Library data of the parts
C108 C110 C112 C113 C115 = C_0402_0.1UF_16V: CAP CER .10UF 16V X7R 0402; Manufacturer: Murata Electronics North America; Manufacturer Part Number: GRM155R71C104KA88J; Tolerance: ±10%; Supplier 1: Digi-Key; RoHS: RoHS Compliant; Category: Capacitors; Stock 1: 18103134; Pricing 1: 1=0.1, 10=0.014, 100=0.0062, 500=0.00442, 1000=0.00348, 2500=0.00316, 5000=0.00291 (USD); Packaging: Cut Tape (CT); Part Status: Active; Operating Temperature: -55°C ~ 125°C; Features: -; Ratings: -; Applications: General Purpose; Mounting Type: Surface Mount, MLCC; Size / Dimension: 0.039" L x 0.020" W (1.00mm x 0.50mm); Height - Seated (Max): -; Thickness (Max): 0.022" (0.55mm); Lead Spacing: -; ComponentLink1URL: http://www.murata.com/~/media/webrenewal/support/library/catalog/products/capacitor/mlcc/c02e.ashx?la=en-us; ComponentLink1Description: http://www.murata.com/~/media/webrenewal/support/library/catalog/products/capacitor/mlcc/c02e.ashx?la=en-us; Supplier Part Number 1: 490-6328-1-ND
C109 C114 = C_0603_4.7uF_10V: CAP CER 4.7UF 10V X5R 0603; Manufacturer: Murata Electronics North America; Manufacturer Part Number: GRM188R61A475KE15D; Tolerance: ±10%; Supplier 1: Digi-Key; RoHS: RoHS Compliant; Category: Capacitors; Stock 1: 163304; Pricing 1: 1=0.15, 10=0.105, 100=0.0495, 500=0.03472, 1000=0.02875 (USD); Mounting Type: Surface Mount, MLCC; Operating Temperature: -55°C ~ 85°C; Features: Derating Recommended; Applications: General Purpose; Ratings: -; Size / Dimension: 0.063" L x 0.032" W (1.60mm x 0.80mm); Lead Spacing: -; Packaging: Cut Tape (CT); Lead Style: -; ComponentLink1URL: http://search.murata.co.jp/Ceramy/image/img/A01X/G101/ENG/GRM188R61A475KE15-01.pdf; ComponentLink1Description: http://search.murata.co.jp/Ceramy/image/img/A01X/G101/ENG/GRM188R61A475KE15-01.pdf; Supplier Part Number 1: 490-10477-1-ND; Capacitance: 4.7µF; Part Status: Active; Height - Seated (Max): -; Thickness (Max): 0.039" (1.00mm)
C111 = C_0805_10UF_10V: CAP CER 10UF 10V 10% X5R 0805; Manufacturer: Murata Electronics North America; Manufacturer Part Number: GRM21BR61A106KE19L; Capacitance: 10µF; TEMPERATURE: -55/85C; Supplier 1: Digi-Key; Supplier Part Number 1: 490-1709-1-ND; RoHS: RoHS Compliant; Category: Capacitors; Stock 1: 541107; Pricing: 1=0.21, 10=0.144, 50=0.0876, 100=0.0735, 250=0.05952, 500=0.0525, 1000=0.04463 (USD); Packaging: Cut Tape (CT); Voltage - Rated: 10V; Temperature Coefficient: X5R; Mounting Type: Surface Mount, MLCC; Operating Temperature: -55°C ~ 85°C; Applications: General Purpose; Ratings: -; Package / Case: 0805 (2012 Metric); Size / Dimension: 0.079" L x 0.049" W (2.00mm x 1.25mm); Height - Seated (Max): -; Thickness (Max): 0.053" (1.35mm); Lead Spacing: -; Features: -; Lead Style: -; ComponentLink1URL: http://www.murata.com/products/catalog/pdf/c02e.pdf; ComponentLink1Description: http://www.murata.com/products/catalog/pdf/c02e.pdf
C116 = C_0402_2.2uF_35V: CAP CER 2.2UF 35V 20% X5R 0402; Manufacturer: TDK Corporation; Manufacturer Part Number: C1005X5R1V225K050BC; Tolerance: ±10%; Supplier 1: Digi-Key; Supplier Part Number 1: 445-9028-1-ND; RoHS: RoHS Compliant; Category: Capacitors; Stock 1: 300469; Packaging: Cut Tape (CT); Mounting Type: Surface Mount, MLCC; Operating Temperature: -55°C ~ 85°C; Applications: General Purpose; Ratings: -; Size / Dimension: 0.039" L x 0.020" W (1.00mm x 0.50mm); Height - Seated (Max): -; Thickness (Max): 0.022" (0.55mm); Lead Spacing: -; Features: Low ESL; Lead Style: -; ComponentLink1URL: https://product.tdk.com/info/en/catalog/datasheets/mlcc_commercial_general_en.pdf; ComponentLink1Description: https://product.tdk.com/info/en/catalog/datasheets/mlcc_commercial_general_en.pdf; Pricing 1: 1=0.36, 10=0.253, 100=0.1518, 500=0.11386, 1000=0.09614, 2500=0.09108, 5000=0.08602 (USD); Part Status: Active; Failure Rate: -
R112 = R_0402_0.00: RES SMD 0.0OHM JUMPER 1/10W 0402; Manufacturer: Panasonic - ECG; Manufacturer Part Number: ERJ-2GE0R00X; Resistance (Ohms): 0.0; Supplier 1: Digi-Key; Supplier Part Number 1: P0.0JCT-ND; RoHS: RoHS Compliant; Category: Resistors; Stock 1: 9828264; Pricing: 1=0.05, 50=0.0172, 100=0.0131, 250=0.00976, 500=0.0072, 1000=0.0048, 5000=0.00338 (USD); Composition: Thick Film; Features: -; Temperature Coefficient: -; Package / Case: 0402 (1005 Metric); Size / Dimension: 0.039" L x 0.020" W (1.00mm x 0.50mm); Height: 0.016" (0.40mm); Number of Terminations: 2; Packaging: Cut Tape (CT); ComponentLink1URL: http://industrial.panasonic.com/www-cgi/jvcr13pz.cgi?E+PZ+3+AOA0001+ERJ2GE0R00X+7+WW; ComponentLink1Description: http://industrial.panasonic.com/www-cgi/jvcr13pz.cgi?E+PZ+3+AOA0001+ERJ2GE0R00X+7+WW
R113 R115 = R_0402_100K: RES SMD 100K OHM 1% 1/16W 0402; Manufacturer: Yageo; Manufacturer Part Number: RC0402FR-07100KL; Temperature Coefficient: ±100ppm/°C; Supplier 1: Digi-Key; RoHS: RoHS Compliant; Category: Resistors; Stock 1: 4989982; Pricing 1: 1=0.1, 10=0.013, 25=0.0096, 100=0.0054, 250=0.00412, 500=0.00328, 1000=0.00242, 2500=0.0021, 5000=0.00173 (USD); Packaging: Cut Tape (CT); Resistance (Ohms): 100k; Composition: Thick Film; Features: Moisture Resistant; Operating Temperature: -55°C ~ 155°C; Package / Case: 0402 (1005 Metric); Supplier Device Package: 0402; Size / Dimension: 0.039" L x 0.020" W (1.00mm x 0.50mm); Height: 0.016" (0.40mm); Number of Terminations: 2; ComponentLink1URL: http://www.yageo.com/NewPortal/yageodocoutput?fileName=/pdf/R-Chip/PYu-RC_Group_51_RoHS_L_3.pdf; ComponentLink1Description: http://www.yageo.com/NewPortal/yageodocoutput?fileName=/pdf/R-Chip/PYu-RC_Group_51_RoHS_L_3.pdf; Supplier Part Number 1: 311-100KLRCT-ND
R114 = R_0402_8.06K: RES 8.06K OHM 1/16W 1% 0402 SMD; Manufacturer: Yageo; Manufacturer Part Number: RC0402FR-078K06L; Temperature Coefficient: ±100ppm/°C; Supplier 1: Digi-Key; Supplier Part Number 1: 311-8.06KLRCT-ND; RoHS: RoHS Compliant; Category: Resistors; Stock 1: 102694; Pricing: 10=0.014, 50=0.0104, 100=0.0079, 250=0.00584, 500=0.00432, 1000=0.00288 (USD); Resistance (Ohms): 8.06K; Composition: Thick Film; Features: -; Size / Dimension: 0.039" L x 0.020" W (1.00mm x 0.50mm); Height: 0.016" (0.40mm); Number of Terminations: 2; Packaging: Cut Tape (CT); Package / Case: 0402 (1005 Metric); ComponentLink1URL: http://www.yageo.com/documents/recent/PYu-RC0402_51_RoHS_L_6.pdf; ComponentLink1Description: http://www.yageo.com/documents/recent/PYu-RC0402_51_RoHS_L_6.pdf
R176 = R_0402_10.0K: as R69 on sheet I2S Audio; Supplier 1: Digi-Key; Supplier Part Number 1: RMCF0402FT10K0CT-ND; RoHS: RoHS Compliant; Category: Resistors; Stock 1: 234525; Pricing: 1=0.04, 10=0.025, 50=0.0138, 100=0.0105, 250=0.0078, 500=0.00576, 1000=0.00384, 2500=0.00324, 5000=0.0027 (USD); Composition: Thick Film; Features: -; Package / Case: 0402 (1005 Metric); Size / Dimension: 0.039" L x 0.020" W (1.00mm x 0.50mm); Height: 0.016" (0.40mm); Number of Terminations: 2; Packaging: Cut Tape (CT); ComponentLink1URL: http://www.seielect.com/Catalog/SEI-RMCF_RMCP.pdf; ComponentLink1Description: http://www.seielect.com/Catalog/SEI-RMCF_RMCP.pdf
U14 = U_OSC_24MHZ_SMD_1.8V: 24MHz CMOS XO (Standard) Oscillator; Function: Standby (Power Down); Frequency Stability: ±50ppm; Current - Supply (Max): 5mA; Current - Supply (Disable) (Max): 10µA; Supplier 1: Digi-Key; RoHS: RoHS Compliant; Category: Crystals, Oscillators, Resonators; Stock 1: 6138; Pricing 1: 1=1.41, 10=1.348, 50=1.3168, 100=1.1286, 500=1.09726, 1000=0.92483 (USD); Packaging: Cut Tape (CT); Part Status: Active; Type: XO (Standard); Output: CMOS; Operating Temperature: -10°C ~ 70°C; Ratings: -; Mounting Type: Surface Mount; Package / Case: 4-SMD, No Lead; Size / Dimension: 0.098" L x 0.079" W (2.50mm x 2.00mm); Height - Seated (Max): 0.028" (0.70mm); ComponentLink1URL: http://global.kyocera.com/prdct/electro/product/pdf/kc2520b_c1_e.pdf; ComponentLink1Description: http://global.kyocera.com/prdct/electro/product/pdf/kc2520b_c1_e.pdf; Supplier Part Number 1: 478-4778-1-ND
U15 = U_USB3315C: IC TXRX USB FLEXPWR 24QFN; Manufacturer: Microchip Technology; Manufacturer Part Number: USB3315C-CP-TR; Protocol: USB 2.0; Number of Drivers/Receivers: 1/1; Voltage - Supply: 1.8 V ~ 3.3 V; Supplier 1: Digi-Key; RoHS: RoHS Compliant; Category: Integrated Circuits (ICs); Stock 1: 12400; Pricing 1: 1=1.28, 25=1.0712, 100=0.9682 (USD); Packaging: Cut Tape (CT); Part Status: Active; Type: Transceiver; Duplex: -; Data Rate: -; Operating Temperature: -40°C ~ 85°C; Mounting Type: Surface Mount; Package / Case: 24-VFQFN Exposed Pad; Supplier Device Package: 24-QFN (4x4); ComponentLink1URL: http://www.microchip.com/mymicrochip/filehandler.aspx?ddocname=en562026; ComponentLink1Description: http://www.microchip.com/mymicrochip/filehandler.aspx?ddocname=en562026; Supplier Part Number 1: USB3315C-CP-CT-ND

## Sheet FMC 400 Pin.SchDoc: Altium FMC Sheet
size A3; Date: 8/14/2017; ApprovedBy: NA; CompanyName: Cospan Design LLC; DrawnBy: Altium; Engineer: Altium; DocumentNumber: 16; Revision: A; SheetNumber: 16; SheetTotal: 20; Project: Enigma; SheetName: Altium FMC Sheet; ProjectPrettyName: Enigma; Client: Public
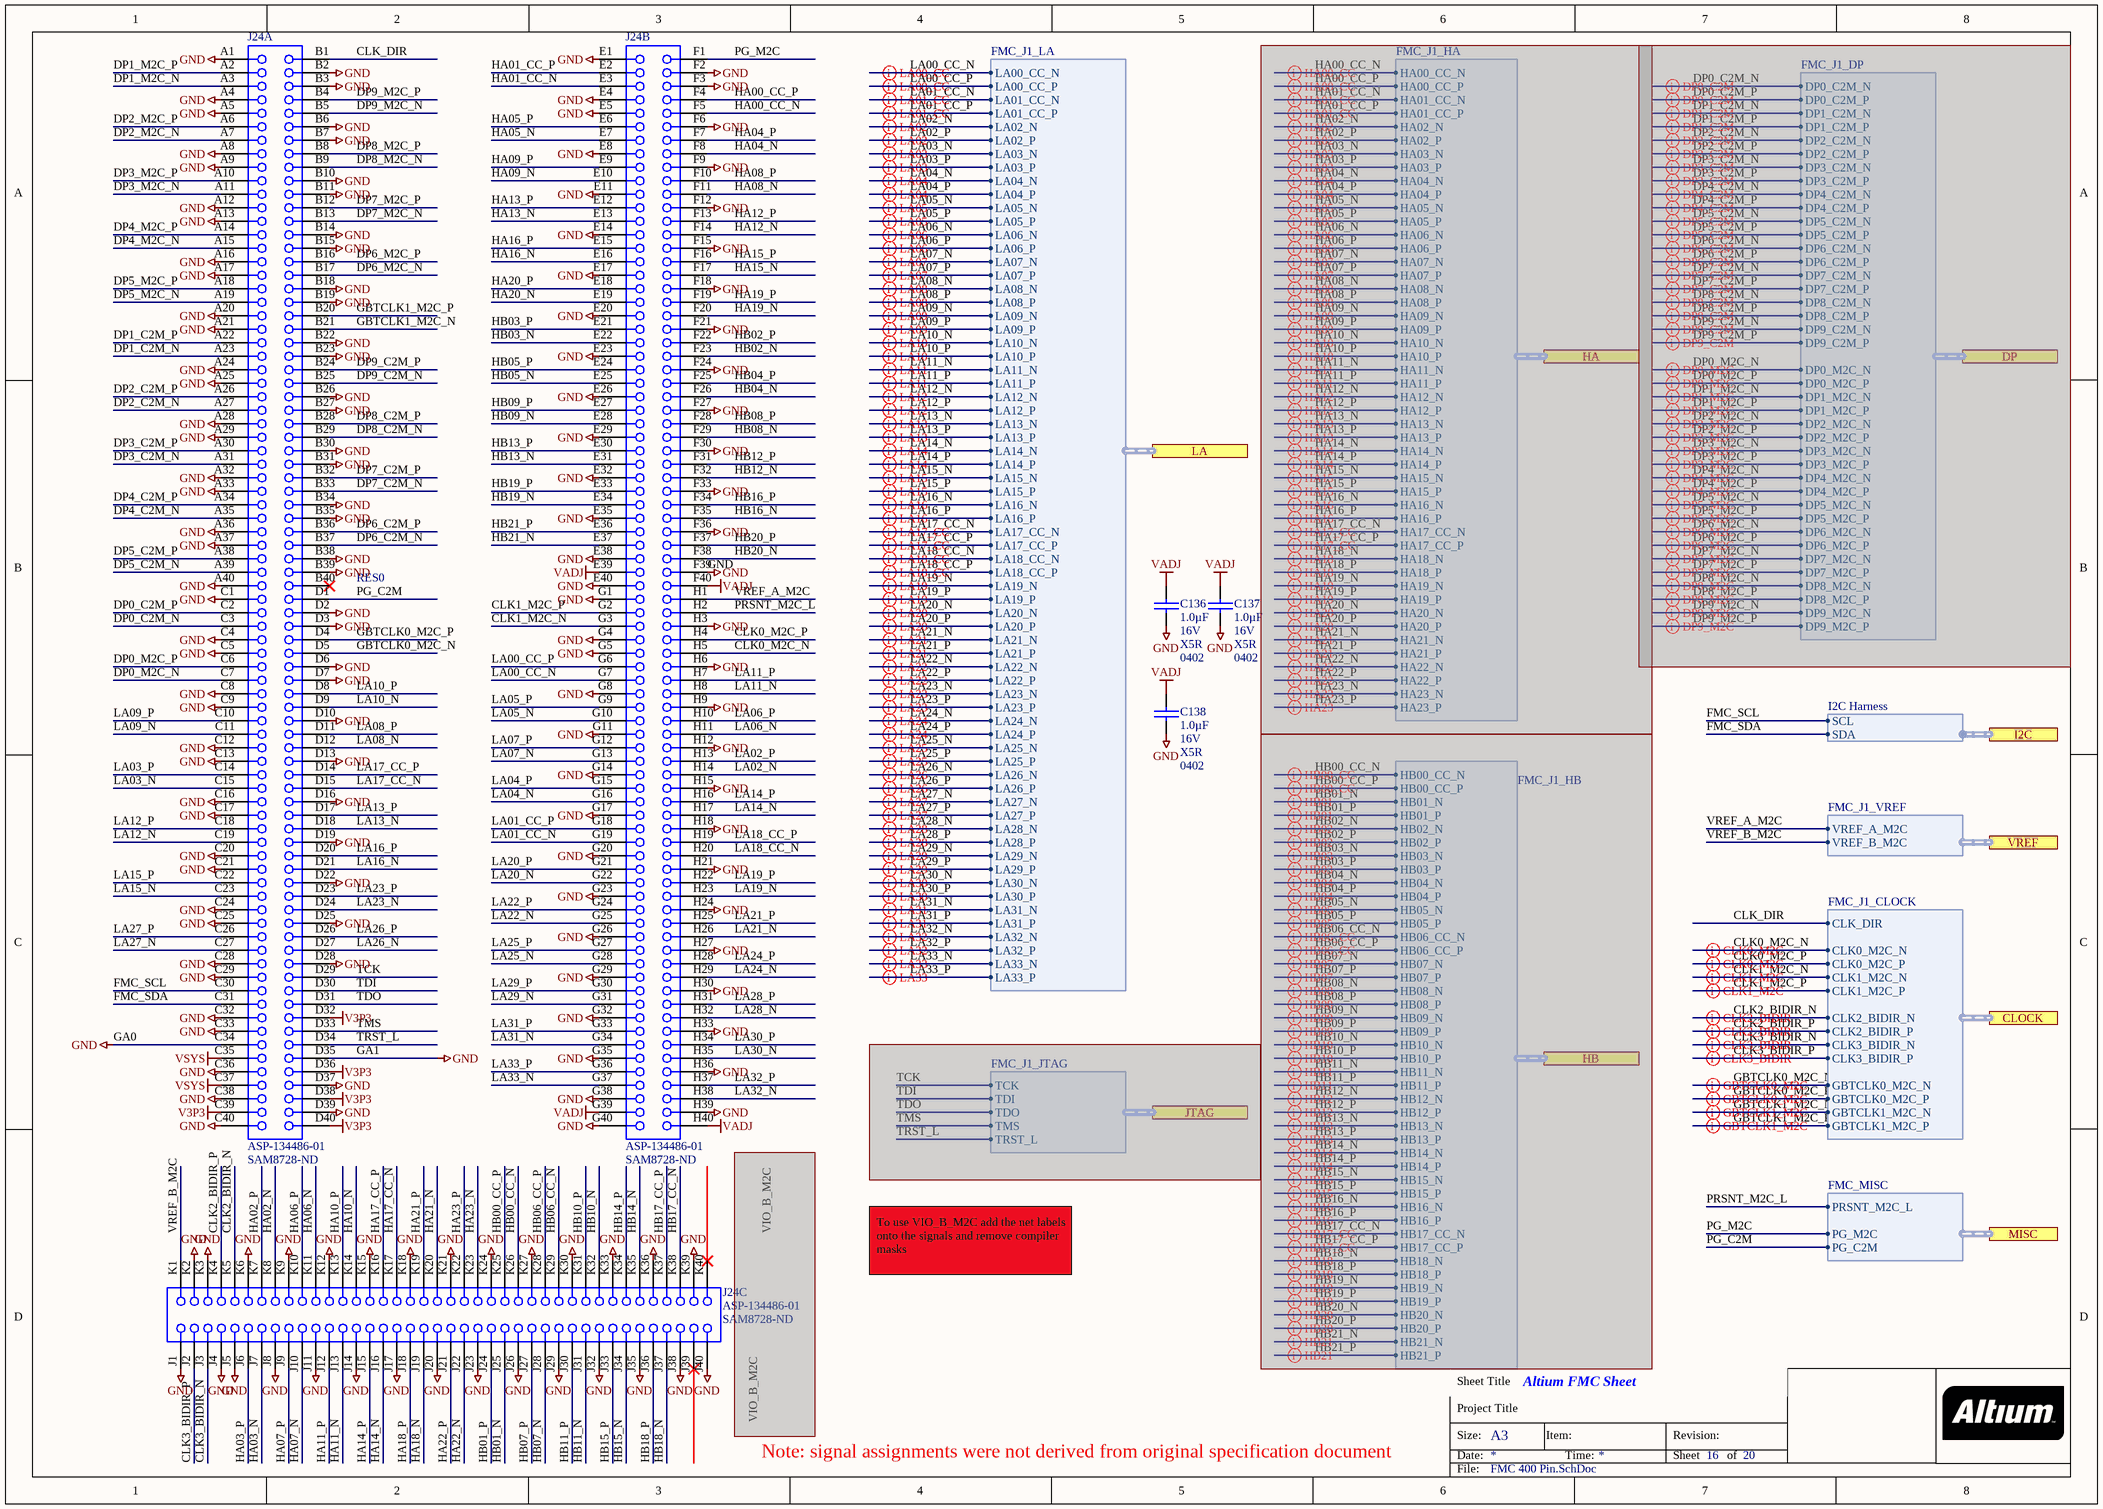
[diagram p10: FMC 400 Pin.SchDoc]

### Parts
C136  Capacitance: 1.0µF  Voltage - Rated: 16V  Temperature Coefficient: X5R  Package / Case: 0402  [C_ERA-0402]  (hidden comment: 1.0uF)
C137  Capacitance: 1.0µF  Voltage - Rated: 16V  Temperature Coefficient: X5R  Package / Case: 0402  [C_ERA-0402]  (hidden comment: 1.0uF)
C138  Capacitance: 1.0µF  Voltage - Rated: 16V  Temperature Coefficient: X5R  Package / Case: 0402  [C_ERA-0402]  (hidden comment: 1.0uF)
J24  ASP-134486-01  Supplier Part Number 1: SAM8728-ND  [BTB-SM1-27-2V400F]  (parts A,B,C of 3)

### Ports
CLOCK (harness FMC_J1_CLOCK), DP (harness FMC_J1_DP), HA (harness FMC_J1_HA), HB (harness FMC_J1_HB), I2C (harness I2C Harness), JTAG (harness FMC_J1_JTAG), LA (harness FMC_J1_LA), MISC (harness FMC_MISC), VREF (harness FMC_J1_VREF)

### Harnesses
FMC_J1_DP: DP1_C2M_N, DP1_C2M_P, DP1_M2C_N, DP1_M2C_P, DP2_C2M_N, DP2_C2M_P, DP2_M2C_N, DP2_M2C_P, DP3_C2M_N, DP3_C2M_P, DP3_M2C_N, DP3_M2C_P, DP4_C2M_N, DP4_C2M_P, DP4_M2C_N, DP4_M2C_P, DP5_C2M_N, DP5_C2M_P, DP5_M2C_N, DP5_M2C_P, DP6_C2M_N, DP6_C2M_P, DP6_M2C_N, DP6_M2C_P, DP7_C2M_N, DP7_C2M_P, DP7_M2C_N, DP7_M2C_P, DP8_C2M_N, DP8_C2M_P, DP8_M2C_N, DP8_M2C_P, DP9_C2M_N, DP9_C2M_P, DP9_M2C_N, DP9_M2C_P, DP0_C2M_N, DP0_C2M_P, DP0_M2C_N, DP0_M2C_P
FMC_J1_LA: LA05_N, LA05_P, LA06_N, LA06_P, LA09_N, LA09_P, LA10_N, LA10_P, LA13_N, LA13_P, LA14_N, LA14_P, LA23_N, LA23_P, LA26_N, LA26_P, LA27_N, LA27_P, LA02_N, LA02_P, LA03_N, LA03_P, LA04_N, LA04_P, LA07_N, LA07_P, LA08_N, LA08_P, LA11_N, LA11_P, LA12_N, LA12_P, LA15_N, LA15_P, LA16_N, LA16_P, LA19_N, LA19_P, LA20_N, LA20_P, LA21_N, LA21_P, LA22_N, LA22_P, LA24_N, LA24_P, LA25_N, LA25_P, LA28_N, LA28_P, LA29_N, LA29_P, LA30_N, LA30_P, LA31_N, LA31_P, LA32_N, LA32_P, LA33_N, LA33_P, LA00_CC_N, LA00_CC_P, LA01_CC_N, LA01_CC_P, LA17_CC_N, LA17_CC_P, LA18_CC_N, LA18_CC_P
FMC_J1_HA: HA04_N, HA04_P, HA05_N, HA05_P, HA08_N, HA08_P, HA09_N, HA09_P, HA12_N, HA12_P, HA13_N, HA13_P, HA15_N, HA15_P, HA16_N, HA16_P, HA19_N, HA19_P, HA20_N, HA20_P, HA02_N, HA02_P, HA03_N, HA03_P, HA06_N, HA06_P, HA07_N, HA07_P, HA10_N, HA10_P, HA11_N, HA11_P, HA14_N, HA14_P, HA18_N, HA18_P, HA21_N, HA21_P, HA22_N, HA22_P, HA23_N, HA23_P, HA17_CC_N, HA17_CC_P, HA00_CC_N, HA00_CC_P, HA01_CC_N, HA01_CC_P
FMC_J1_HB: HB02_N, HB02_P, HB03_N, HB03_P, HB04_N, HB04_P, HB05_N, HB05_P, HB08_N, HB08_P, HB09_N, HB09_P, HB12_N, HB12_P, HB13_N, HB13_P, HB16_N, HB16_P, HB19_N, HB19_P, HB20_N, HB20_P, HB21_N, HB21_P, HB01_N, HB01_P, HB07_N, HB07_P, HB10_N, HB10_P, HB11_N, HB11_P, HB14_N, HB14_P, HB15_N, HB15_P, HB18_N, HB18_P, HB17_CC_N, HB17_CC_P, HB06_CC_N, HB06_CC_P, HB00_CC_N, HB00_CC_P
FMC_MISC: PRSNT_M2C_L, PG_M2C, PG_C2M
FMC_J1_JTAG: TCK, TDI, TDO, TMS, TRST_L
FMC_J1_CLOCK: CLK2_BIDIR_N, CLK2_BIDIR_P, CLK3_BIDIR_N, CLK3_BIDIR_P, CLK0_M2C_N, CLK0_M2C_P, CLK1_M2C_N, CLK1_M2C_P, CLK_DIR, GBTCLK0_M2C_N, GBTCLK0_M2C_P, GBTCLK1_M2C_N, GBTCLK1_M2C_P
FMC_J1_VREF: VREF_A_M2C, VREF_B_M2C
I2C Harness: SCL, SDA

### Nets
GND: C136.1 C137.1 C138.1 J24.A1 J24.A4 J24.A5 J24.A8 J24.A9 J24.A12 J24.A13 J24.A16 J24.A17 J24.A20 J24.A21 J24.A24 J24.A25 J24.A28 J24.A29 J24.A32 J24.A33 J24.A36 J24.A37 J24.A40 J24.B2 J24.B3 J24.B6 J24.B7 J24.B10 J24.B11 J24.B14 J24.B15 J24.B18 J24.B19 J24.B22 J24.B23 J24.B26 J24.B27 J24.B30 J24.B31 J24.B34 J24.B35 J24.B38 J24.B39 J24.C1 J24.C4 J24.C5 J24.C8 J24.C9 J24.C12 J24.C13 J24.C16 J24.C17 J24.C20 J24.C21 J24.C24 J24.C25 J24.C28 J24.C29 J24.C32 J24.C33 J24.C34 J24.C36 J24.C38 J24.C40 J24.D2 J24.D3 J24.D6 J24.D7 J24.D10 J24.D13 J24.D16 J24.D19 J24.D22 J24.D25 J24.D28 J24.D35 J24.D37 J24.D39 J24.E1 J24.E4 J24.E5 J24.E8 J24.E11 J24.E14 J24.E17 J24.E20 J24.E23 J24.E26 J24.E29 J24.E32 J24.E35 J24.E38 J24.E40 J24.F2 J24.F3 J24.F6 J24.F9 J24.F12 J24.F15 J24.F18 J24.F21 J24.F24 J24.F27 J24.F30 J24.F33 J24.F36 J24.F39 J24.G1 J24.G4 J24.G5 J24.G8 J24.G11 J24.G14 J24.G17 J24.G20 J24.G23 J24.G26 J24.G29 J24.G32 J24.G35 J24.G38 J24.G40 J24.H3 J24.H6 J24.H9 J24.H12 J24.H15 J24.H18 J24.H21 J24.H24 J24.H27 J24.H30 J24.H33 J24.H36 J24.H39 J24.J1 J24.J4 J24.J5 J24.J8 J24.J11 J24.J14 J24.J17 J24.J20 J24.J23 J24.J26 J24.J29 J24.J32 J24.J35 J24.J38 J24.J40 J24.K2 J24.K3 J24.K6 J24.K9 J24.K12 J24.K15 J24.K18 J24.K21 J24.K24 J24.K27 J24.K30 J24.K33 J24.K36 J24.K39  [also labelled GA0, GA1]
V3P3: J24.C39 J24.D32 J24.D36 J24.D38 J24.D40
VADJ: C136.2 C137.2 C138.2 J24.E39 J24.F40 J24.G39 J24.H1 J24.H40 ; port VREF.VREF_A_M2C  [also labelled VREF_A_M2C]
VSYS: J24.C35 J24.C37
CLK0_M2C_N: J24.H5 ; port CLOCK.CLK0_M2C_N
CLK0_M2C_P: J24.H4 ; port CLOCK.CLK0_M2C_P
CLK1_M2C_N: J24.G3 ; port CLOCK.CLK1_M2C_N
CLK1_M2C_P: J24.G2 ; port CLOCK.CLK1_M2C_P
CLK2_BIDIR_N: J24.K5 ; port CLOCK.CLK2_BIDIR_N
CLK2_BIDIR_P: J24.K4 ; port CLOCK.CLK2_BIDIR_P
CLK3_BIDIR_N: J24.J3 ; port CLOCK.CLK3_BIDIR_N
CLK3_BIDIR_P: J24.J2 ; port CLOCK.CLK3_BIDIR_P
CLK_DIR: J24.B1 ; port CLOCK.CLK_DIR
DP0_C2M_N: J24.C3
DP0_C2M_P: J24.C2
DP0_M2C_N: J24.C7
DP0_M2C_P: J24.C6
DP1_C2M_N: J24.A23
DP1_C2M_P: J24.A22
DP1_M2C_N: J24.A3
DP1_M2C_P: J24.A2
DP2_C2M_N: J24.A27
DP2_C2M_P: J24.A26
DP2_M2C_N: J24.A7
DP2_M2C_P: J24.A6
DP3_C2M_N: J24.A31
DP3_C2M_P: J24.A30
DP3_M2C_N: J24.A11
DP3_M2C_P: J24.A10
DP4_C2M_N: J24.A35
DP4_C2M_P: J24.A34
DP4_M2C_N: J24.A15
DP4_M2C_P: J24.A14
DP5_C2M_N: J24.A39
DP5_C2M_P: J24.A38
DP5_M2C_N: J24.A19
DP5_M2C_P: J24.A18
DP6_C2M_N: J24.B37
DP6_C2M_P: J24.B36
DP6_M2C_N: J24.B17
DP6_M2C_P: J24.B16
DP7_C2M_N: J24.B33
DP7_C2M_P: J24.B32
DP7_M2C_N: J24.B13
DP7_M2C_P: J24.B12
DP8_C2M_N: J24.B29
DP8_C2M_P: J24.B28
DP8_M2C_N: J24.B9
DP8_M2C_P: J24.B8
DP9_C2M_N: J24.B25
DP9_C2M_P: J24.B24
DP9_M2C_N: J24.B5
DP9_M2C_P: J24.B4
FMC_SCL: J24.C30 ; port I2C.SCL
FMC_SDA: J24.C31 ; port I2C.SDA
GBTCLK0_M2C_N: J24.D5 ; port CLOCK.GBTCLK0_M2C_N
GBTCLK0_M2C_P: J24.D4 ; port CLOCK.GBTCLK0_M2C_P
GBTCLK1_M2C_N: J24.B21 ; port CLOCK.GBTCLK1_M2C_N
GBTCLK1_M2C_P: J24.B20 ; port CLOCK.GBTCLK1_M2C_P
HA00_CC_N: J24.F5
HA00_CC_P: J24.F4
HA01_CC_N: J24.E3
HA01_CC_P: J24.E2
HA02_N: J24.K8
HA02_P: J24.K7
HA03_N: J24.J7
HA03_P: J24.J6
HA04_N: J24.F8
HA04_P: J24.F7
HA05_N: J24.E7
HA05_P: J24.E6
HA06_N: J24.K11
HA06_P: J24.K10
HA07_N: J24.J10
HA07_P: J24.J9
HA08_N: J24.F11
HA08_P: J24.F10
HA09_N: J24.E10
HA09_P: J24.E9
HA10_N: J24.K14
HA10_P: J24.K13
HA11_N: J24.J13
HA11_P: J24.J12
HA12_N: J24.F14
HA12_P: J24.F13
HA13_N: J24.E13
HA13_P: J24.E12
HA14_N: J24.J16
HA14_P: J24.J15
HA15_N: J24.F17
HA15_P: J24.F16
HA16_N: J24.E16
HA16_P: J24.E15
HA17_CC_N: J24.K17
HA17_CC_P: J24.K16
HA18_N: J24.J19
HA18_P: J24.J18
HA19_N: J24.F20
HA19_P: J24.F19
HA20_N: J24.E19
HA20_P: J24.E18
HA21_N: J24.K20
HA21_P: J24.K19
HA22_N: J24.J22
HA22_P: J24.J21
HA23_N: J24.K23
HA23_P: J24.K22
HB00_CC_N: J24.K26
HB00_CC_P: J24.K25
HB01_N: J24.J25
HB01_P: J24.J24
HB02_N: J24.F23
HB02_P: J24.F22
HB03_N: J24.E22
HB03_P: J24.E21
HB04_N: J24.F26
HB04_P: J24.F25
HB05_N: J24.E25
HB05_P: J24.E24
HB06_CC_N: J24.K29
HB06_CC_P: J24.K28
HB07_N: J24.J28
HB07_P: J24.J27
HB08_N: J24.F29
HB08_P: J24.F28
HB09_N: J24.E28
HB09_P: J24.E27
HB10_N: J24.K32
HB10_P: J24.K31
HB11_N: J24.J31
HB11_P: J24.J30
HB12_N: J24.F32
HB12_P: J24.F31
HB13_N: J24.E31
HB13_P: J24.E30
HB14_N: J24.K35
HB14_P: J24.K34
HB15_N: J24.J34
HB15_P: J24.J33
HB16_N: J24.F35
HB16_P: J24.F34
HB17_CC_N: J24.K38
HB17_CC_P: J24.K37
HB18_N: J24.J37
HB18_P: J24.J36
HB19_N: J24.E34
HB19_P: J24.E33
HB20_N: J24.F38
HB20_P: J24.F37
HB21_N: J24.E37
HB21_P: J24.E36
LA00_CC_N: J24.G7 ; port LA.LA00_CC_N
LA00_CC_P: J24.G6 ; port LA.LA00_CC_P
LA01_CC_N: J24.G19 ; port LA.LA01_CC_N
LA01_CC_P: J24.G18 ; port LA.LA01_CC_P
LA02_N: J24.H14 ; port LA.LA02_N
LA02_P: J24.H13 ; port LA.LA02_P
LA03_N: J24.C15 ; port LA.LA03_N
LA03_P: J24.C14 ; port LA.LA03_P
LA04_N: J24.G16 ; port LA.LA04_N
LA04_P: J24.G15 ; port LA.LA04_P
LA05_N: J24.G10 ; port LA.LA05_N
LA05_P: J24.G9 ; port LA.LA05_P
LA06_N: J24.H11 ; port LA.LA06_N
LA06_P: J24.H10 ; port LA.LA06_P
LA07_N: J24.G13 ; port LA.LA07_N
LA07_P: J24.G12 ; port LA.LA07_P
LA08_N: J24.D12 ; port LA.LA08_N
LA08_P: J24.D11 ; port LA.LA08_P
LA09_N: J24.C11 ; port LA.LA09_N
LA09_P: J24.C10 ; port LA.LA09_P
LA10_N: J24.D9 ; port LA.LA10_N
LA10_P: J24.D8 ; port LA.LA10_P
LA11_N: J24.H8 ; port LA.LA11_N
LA11_P: J24.H7 ; port LA.LA11_P
LA12_N: J24.C19 ; port LA.LA12_N
LA12_P: J24.C18 ; port LA.LA12_P
LA13_N: J24.D18 ; port LA.LA13_N
LA13_P: J24.D17 ; port LA.LA13_P
LA14_N: J24.H17 ; port LA.LA14_N
LA14_P: J24.H16 ; port LA.LA14_P
LA15_N: J24.C23 ; port LA.LA15_N
LA15_P: J24.C22 ; port LA.LA15_P
LA16_N: J24.D21 ; port LA.LA16_N
LA16_P: J24.D20 ; port LA.LA16_P
LA17_CC_N: J24.D15 ; port LA.LA17_CC_N
LA17_CC_P: J24.D14 ; port LA.LA17_CC_P
LA18_CC_N: J24.H20 ; port LA.LA18_CC_N
LA18_CC_P: J24.H19 ; port LA.LA18_CC_P
LA19_N: J24.H23 ; port LA.LA19_N
LA19_P: J24.H22 ; port LA.LA19_P
LA20_N: J24.G22 ; port LA.LA20_N
LA20_P: J24.G21 ; port LA.LA20_P
LA21_N: J24.H26 ; port LA.LA21_N
LA21_P: J24.H25 ; port LA.LA21_P
LA22_N: J24.G25 ; port LA.LA22_N
LA22_P: J24.G24 ; port LA.LA22_P
LA23_N: J24.D24 ; port LA.LA23_N
LA23_P: J24.D23 ; port LA.LA23_P
LA24_N: J24.H29 ; port LA.LA24_N
LA24_P: J24.H28 ; port LA.LA24_P
LA25_N: J24.G28 ; port LA.LA25_N
LA25_P: J24.G27 ; port LA.LA25_P
LA26_N: J24.D27 ; port LA.LA26_N
LA26_P: J24.D26 ; port LA.LA26_P
LA27_N: J24.C27 ; port LA.LA27_N
LA27_P: J24.C26 ; port LA.LA27_P
LA28_N: J24.H32 ; port LA.LA28_N
LA28_P: J24.H31 ; port LA.LA28_P
LA29_N: J24.G31 ; port LA.LA29_N
LA29_P: J24.G30 ; port LA.LA29_P
LA30_N: J24.H35 ; port LA.LA30_N
LA30_P: J24.H34 ; port LA.LA30_P
LA31_N: J24.G34 ; port LA.LA31_N
LA31_P: J24.G33 ; port LA.LA31_P
LA32_N: J24.H38 ; port LA.LA32_N
LA32_P: J24.H37 ; port LA.LA32_P
LA33_N: J24.G37 ; port LA.LA33_N
LA33_P: J24.G36 ; port LA.LA33_P
PG_C2M: J24.D1 ; port MISC.PG_C2M
PG_M2C: J24.F1 ; port MISC.PG_M2C
PRSNT_M2C_L: J24.H2 ; port MISC.PRSNT_M2C_L
TCK: J24.D29
TDI: J24.D30
TDO: J24.D31
TMS: J24.D33
TRST_L: J24.D34
VREF_B_M2C: J24.K1 ; port VREF.VREF_B_M2C

Not connected (* = marked no-connect by the designer): J24 B40* J39* K40*

### Layout directives
differential pair: (no net found under the mark), CLK0_M2C_N, CLK0_M2C_P, CLK1_M2C_N, CLK1_M2C_P, CLK2_BIDIR_N, CLK2_BIDIR_P, CLK3_BIDIR_N, CLK3_BIDIR_P, GBTCLK0_M2C_N, GBTCLK0_M2C_P, GBTCLK1_M2C_N, GBTCLK1_M2C_P, LA00_CC_N, LA00_CC_P, LA01_CC_N, LA01_CC_P, LA02_N, LA02_P, LA03_N, LA03_P, LA04_N, LA04_P, LA05_N, LA05_P, LA06_N, LA06_P, LA07_N, LA07_P, LA08_N, LA08_P, LA09_N, LA09_P, LA10_N, LA10_P, LA11_N, LA11_P, LA12_N, LA12_P, LA13_N, LA13_P, LA14_N, LA14_P, LA15_N, LA15_P, LA16_N, LA16_P, LA17_CC_N, LA17_CC_P, LA18_CC_N, LA18_CC_P, LA19_N, LA19_P, LA20_N, LA20_P, LA21_N, LA21_P, LA22_N, LA22_P, LA23_N, LA23_P, LA24_N, LA24_P, LA25_N, LA25_P, LA26_N, LA26_P, LA27_N, LA27_P, LA28_N, LA28_P, LA29_N, LA29_P, LA30_N, LA30_P, LA31_N, LA31_P, LA32_N, LA32_P, LA33_N, LA33_P

### Notes on the sheet
- RES0
- To use VIO_B_M2C add the net labels onto the signals and remove compiler masks
- Note: signal assignments were not derived from original specification document
- Sheet Title
- Project Title
- Size:
- Date:
- A3
- Item:
- Time:
- Revision:
- Sheet
- of
- File:

### Library data of the parts
C136-C138 = C_0402_1.0UF_16V: CAP CER 1.0UF 16V X5R 0402; Manufacturer: Taiyo Yuden; Manufacturer Part Number: EMK105BJ105KV-F; Tolerance: ±10%; Supplier 1: Digi-Key; RoHS: RoHS Compliant; Category: Capacitors; Stock 1: 489909; Pricing 1: 1=0.1, 10=0.063, 100=0.028, 500=0.01998, 1000=0.0157, 2500=0.01427, 5000=0.01313 (USD); Packaging: Cut Tape (CT); Part Status: Active; Operating Temperature: -55°C ~ 85°C; Features: -; Ratings: -; Applications: General Purpose; Mounting Type: Surface Mount, MLCC; Size / Dimension: 0.039" L x 0.020" W (1.00mm x 0.50mm); Height - Seated (Max): -; Thickness (Max): 0.022" (0.55mm); Lead Spacing: -; Lead Style: -; ComponentLink1URL: http://ds.yuden.co.jp/TYCOMPAS/ut/detail.do?productNo=EMK105BJ105KV-F&fileName=EMK105BJ105KV-F_SS&mode=specSheetDownload; ComponentLink1Description: http://ds.yuden.co.jp/TYCOMPAS/ut/detail.do?productNo=EMK105BJ105KV-F&fileName=EMK105BJ105KV-F_SS&mode=specSheetDownload; Supplier Part Number 1: 587-2477-1-ND
J24 = J_ASP-134486-01: CONN SNGL-END ARRAY FMALE 400POS; Manufacturer: Samtec Inc.; Connector Type: Array, Female Sockets; Number of Positions: 400; Pitch: 0.050" (1.27mm); Supplier 1: Digi-Key; Manufacturer Part Number: ASP-134486-01; RoHS: RoHS Compliant; Category: Connectors, Interconnects; Stock 1: 64; Pricing 1: 1=20.4, 10=19.67, 25=18.9412, 50=18.5768, 100=18.2125, 250=17.84824, 500=17.484 (USD); Packaging: Tape & Reel (TR); Part Status: Active; Number of Rows: 10; Mounting Type: Surface Mount; Features: Board Guide; Contact Finish: Gold; Contact Finish Thickness: 30µin (0.76µm); Mated Stacking Heights: -; Height Above Board: 0.258" (6.55mm)